# EAGLE design nrfxiao (EAGLE 9.5.2)
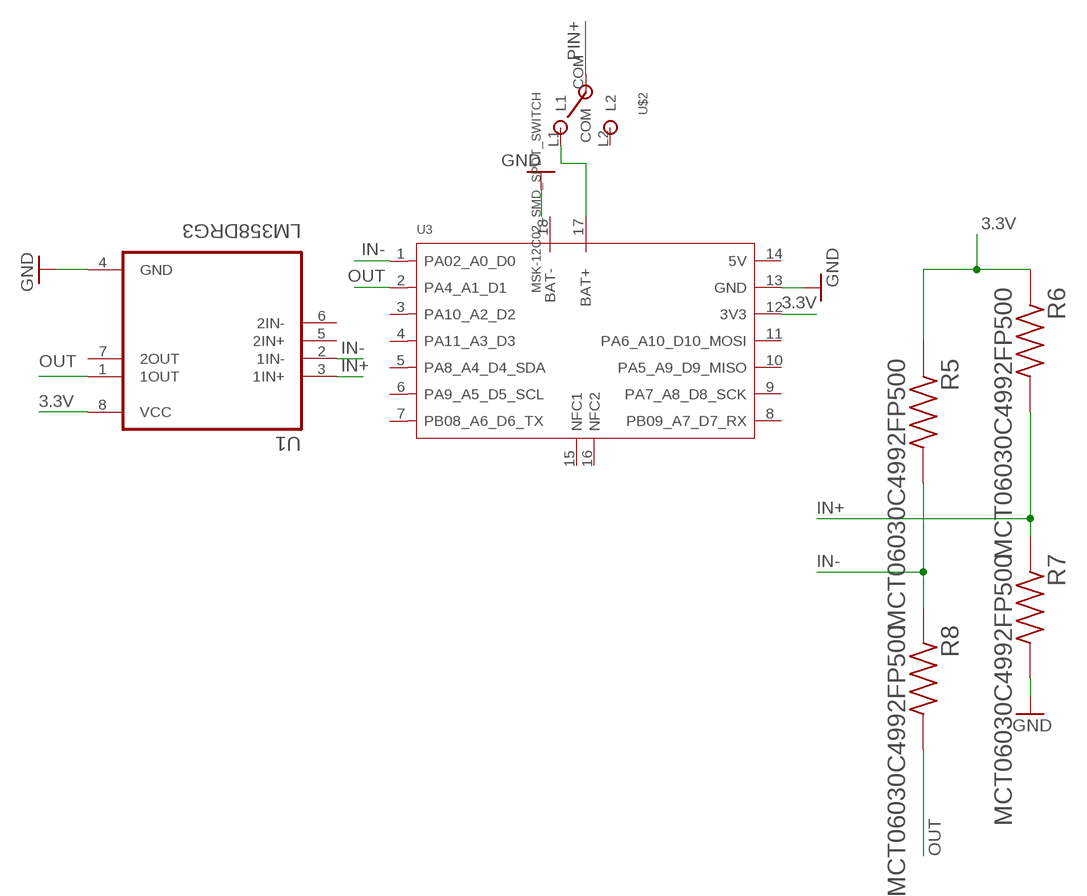
[diagram p0: schematic, sheet 1]

## Parts
R5  MCT06030C4992FP500  [RESC1508X55N]
R6  MCT06030C4992FP500  [RESC1508X55N]
R7  MCT06030C4992FP500  [RESC1508X55N]
R8  MCT06030C4992FP500  [RESC1508X55N]
U1  LM358DRG3  [SOIC127P599X175-8N]
U3  MOUDLE-SEEEDUINO-XIAO-NRF52840-SENSE-SMD  [MOUDLE16P-SMD-2.54-21X17.8MM]
U$2  MSK-12C02_SMD_SPDT_SWITCH  [MSK-12C02]

## Nets
3.3V: R5.1 R6.1 U1.8(VCC) U3.12(3V3)
GND: R7.2 U1.4(GND) U3.13(GND)
IN+: R6.2 R7.1 U1.3(1IN+)
IN-: R5.2 R8.1 U1.2(1IN-) U3.1(PA02_A0_D0)
N$1: U3.17(BAT+) U$2.L1
N$2: U3.18(BAT-) ; supply symbol labelled GND
OUT: R8.2 U1.1(1OUT) U3.2(PA4_A1_D1)
PIN+: U$2.COM
Unconnected: U1.5(2IN+) U1.6(2IN-) U1.7(2OUT) U3.3(PA10_A2_D2) U3.4(PA11_A3_D3) U3.5(PA8_A4_D4_SDA) U3.6(PA9_A5_D5_SCL) U3.7(PB08_A6_D6_TX) U3.8(PB09_A7_D7_RX) U3.9(PA7_A8_D8_SCK) U3.10(PA5_A9_D9_MISO) U3.11(PA6_A10_D10_MOSI) U3.14(5V) U3.15(NFC1) U3.16(NFC2) U$2.L2

## Library data of the parts
R5-R8 = res:MCT06030C4992FP500: RES, THIN FILM, 49K9, 75V, 1%, 0603 Check availability <https://pricing.snapeda.com/parts/MCT06030C4992FP500/Vishay%20Beyschlag/view-part?ref=eda>; AVAILABILITY: In Stock; DESCRIPTION: 49.9 kOhms ±1% 0.125W, 1/8W Chip Resistor 0603 (1608 Metric) Anti-Sulfur Thin Film; MF: Vishay Beyschlag; MP: MCT06030C4992FP500; PACKAGE: 1508 Vishay; PRICE: None; PURCHASE-URL: https://pricing.snapeda.com/search/part/MCT06030C4992FP500/?ref=eda
U1 = lm358dr:LM358DRG3: Check availability <https://pricing.snapeda.com/parts/LM358DRG3/Texas%20Instruments/view-part?ref=eda>; AVAILABILITY: In Stock; DESCRIPTION: Dual, 30-V, 700-kHz operational amplifier; MF: Texas Instruments; MP: LM358DRG3; PACKAGE: SOIC-8 Texas Instruments; PRICE: None; PURCHASE-URL: https://pricing.snapeda.com/search/part/LM358DRG3/?ref=eda
U3 = Seeed-Studio-XIAO-nRF52840-Sense-footprint-eagle:MOUDLE-SEEEDUINO-XIAO-NRF52840-SENSE
U$2 = msk:MSK-12C02_SMD_SPDT_SWITCH: Footprint of the VIMEX MSK-12C02 SPDT SMD Switch Created by mzst on 17-Jan-2016

## Board
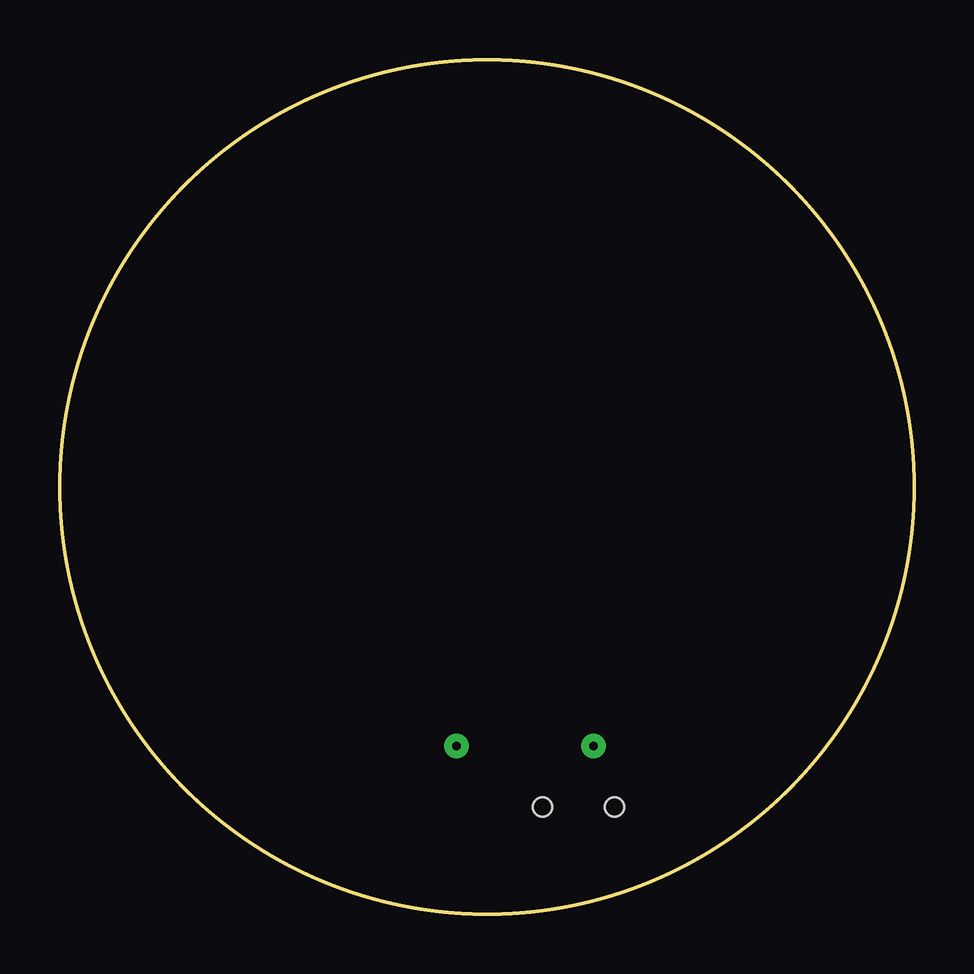
[diagram p1: board, top side]
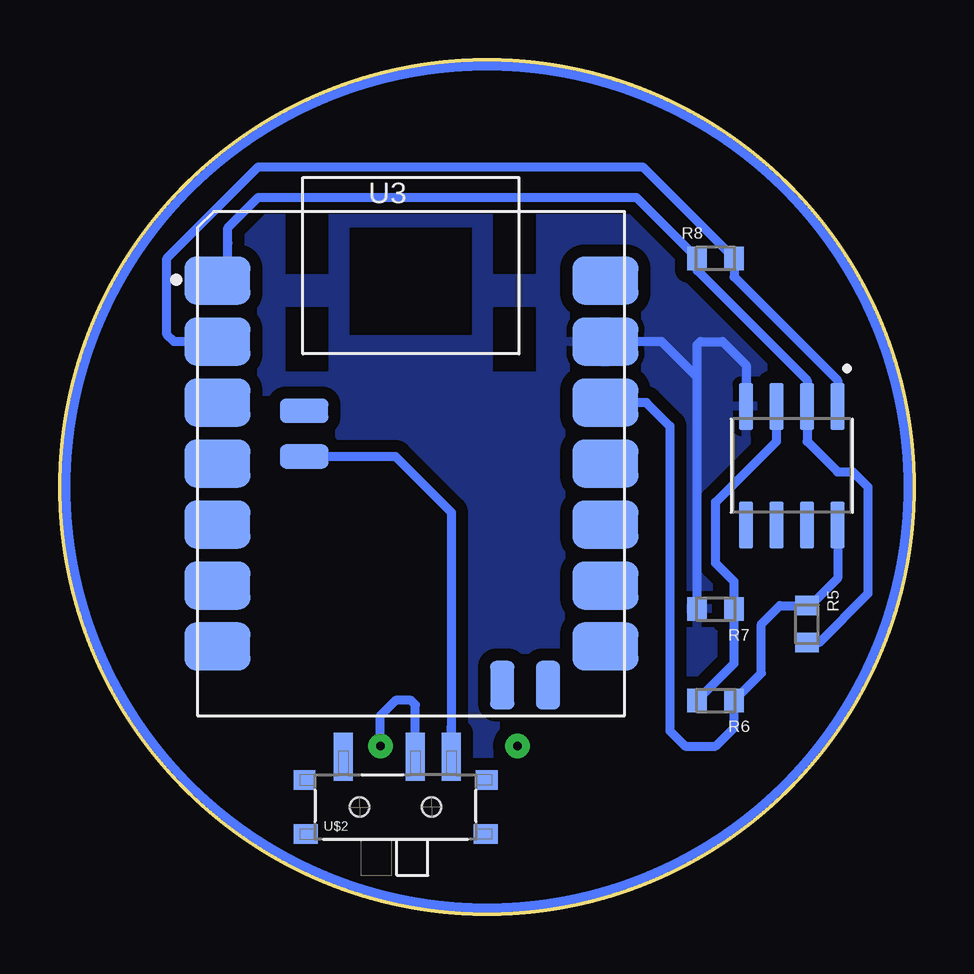
[diagram p2: board, bottom side, seen from below]

Size 35.58 x 35.58 mm. Coordinates in mm from the lower left corner, seen from the top.
Outline: circle at 17.79,17.79 radius 17.79
Copper layers (1*16): Top 0.035mm / dielectric 1.5mm / Bottom 0.035mm
Design rules "default *": minimum track width 15mil, minimum drill 0.35mm, track to track 20mil, track to pad 20mil, pad to pad 20mil, via to via 6mil, smd to smd 6mil, copper to edge 6mil, drill to drill 6mil, minimum pad ring 10mil, minimum via ring 8mil, stop-mask expansion 4mil, vias tented up to drill 0mil, thermal gap 10mil

### Footprints (pad centres in the part's own frame; a part is rotated, then mirrored left to right if it is on the bottom)
RESC1508X55N = smd 0.81 x 0.98: 1 -0.771,0; 2 0.771,0
SOIC127P599X175-8N = smd 1.97 x 0.6: 1 -2.47,1.905; 2 -2.47,0.635; 3 -2.47,-0.635; 4 -2.47,-1.905; 5 2.47,-1.905; 6 2.47,-0.635; 7 2.47,0.635; 8 2.47,1.905
MOUDLE16P-SMD-2.54-21X17.8MM = smd 2.75 x 2: 1 0.835,18.12; 2 0.835,15.58; 3 0.835,13.04; 4 0.835,10.5; 5 0.835,7.96; 6 0.835,5.42; 7 0.835,2.88; 8 17,2.88; 9 17,5.42; 10 17,7.96; 11 17,10.5; 12 17,13.04; 13 17,15.58; 14 17,18.12 | smd 1.016 x 2.032: 15 12.7,1.27; 16 14.605,1.27 | smd 2.032 x 1.016: 17 4.445,10.795; 18 4.445,12.7
MSK-12C02 = smd 0.8 x 2: COM 0.823,2.1; L1 2.323,2.1; L2 -2.177,2.1 | smd 1 x 0.8: GND@1 -3.75,-1.125; GND@4 3.75,-1.125 | smd 0.9 x 0.8: GND@2 -3.8,1.125; GND@3 3.8,1.125 | hole 0.8: -1.5,0; 1.5,0

### Placement (x,y rotation side)
R5  4.46,12.08 270 bottom
R6  8.27,8.9 180 bottom
R7  8.27,12.71 180 bottom
R8  8.27,27.32 0 bottom
U1  5.09,18.68 270 bottom
U3  29.86,8.27 0 bottom
U$2  21.6,4.46 0 bottom

### Tracks (layer width: path | path; a pad name or v marks a point on that pad's centre or on a via)
3.3V
  Bottom 0.381: U1.8 3.19,13.98 4.32,12.85 R5.1 5.59,12.85 6.36,12.08 6.36,10.04 R6.1 7.5,7.77 8.27,7 9.54,7 10.17,7.63 10.17,20.33 11.15,21.31 U3.12
GND
  Bottom 0.381: U1.4 7,22.87 7.97,23.85 8.9,23.85 9.04,23.71 R7.2 9.04,22.37 10.51,23.85 U3.13
  pour Bottom: -3.8,37.48 37.48,37.48 37.48,-0.62 -3.8,-0.62
IN+
  Bottom 0.381: R6.2 7.5,10.44 R7.1 7.5,13.85 8.27,14.62 8.27,17.16 5.73,19.7 U1.3
IN-
  Bottom 0.381: R5.2 3.96,11.31 1.92,13.35 1.92,17.79 2.55,18.43 3.19,18.43 4.46,19.7 U1.2 4.46,22.24 9.04,26.82 R8.1 11.58,29.86 27.32,29.86 28.59,28.59 28.59,27.95 28.59,26.82 U3.1
N$1
  Bottom 0.381: 19.28,7.85 U$2.L1 19.28,16.74 21.6,19.06 U3.17
N$3  (via drill 0.35 pad 1.02)
  other vias: 16.52,7
OUT
  Bottom 0.381: U1.1 3.19,22.24 7.5,26.55 R8.2 11.31,31.13 27.32,31.13 31.13,27.32 31.13,24.14 30.83,23.85 U3.2
PIN+  (via drill 0.35 pad 1.02)
  Bottom 0.381: 20.78,7.44 U$2.COM 20.78,8.71 20.97,8.9 21.6,8.9 22.24,8.27 v22.24,7
(copper drawn outside any net)
  shapes: Bottom circle x1